# EAGLE design Sensor_AD7679 (EAGLE 9.6.2)
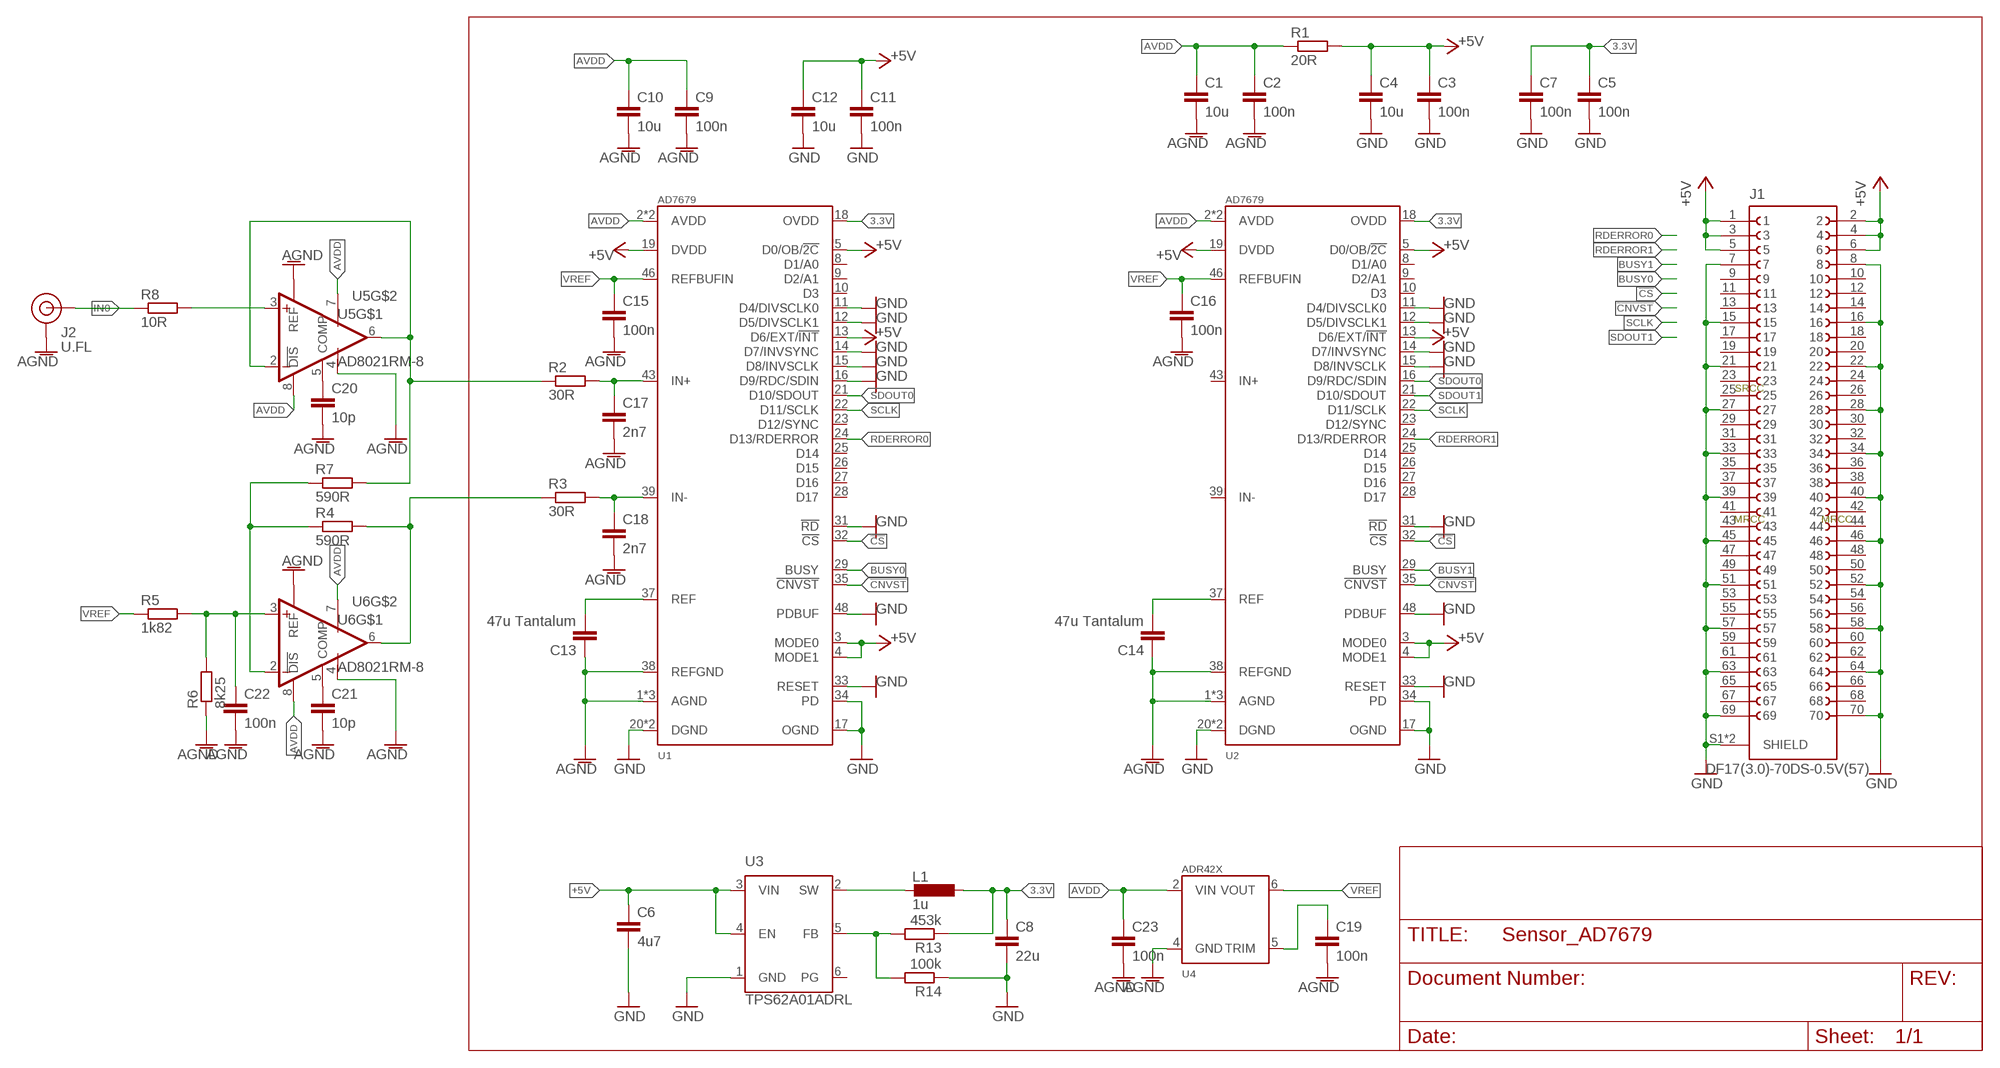
[diagram p0: schematic, sheet 1]

## Parts
C1  10u  C-EUC0603  [C0603]
C2  100n  C-EUC0402  [C0402]
C3  100n  C-EUC0402  [C0402]
C4  10u  C-EUC0603  [C0603]
C5  100n  C-EUC0402  [C0402]
C6  4u7  C-EUC0603  [C0603]
C7  100n  C-EUC0402  [C0402]
C8  22u  C-EUC0603  [C0603]
C9  100n  C-EUC0402  [C0402]
C10  10u  C-EUC0603  [C0603]
C11  100n  C-EUC0402  [C0402]
C12  10u  C-EUC0603  [C0603]
C13  47u Tantalum  C-EUC1206  [C1206]
C14  47u Tantalum  C-EUC1206  [C1206]
C15  100n  C-EUC0402  [C0402]
C16  100n  C-EUC0402  [C0402]
C17  2n7  C-EUC0402  [C0402]
C18  2n7  C-EUC0402  [C0402]
C19  100n  C-EUC0402  [C0402]
C20  10p  C-EUC0402  [C0402]
C21  10p  C-EUC0402  [C0402]
C22  100n  C-EUC0402  [C0402]
C23  100n  C-EUC0402  [C0402]
J1  DF17(3.0)-70DS-0.5V(57)  [DF17(3.0)-70DS-0.5V(57)]
J2  U.FL  U.FL2PIN  [U.FL]
L1  1u  L-EU1008  [L1008]
R1  20R  R-EU_R0402  [R0402]
R2  30R  R-EU_R0402  [R0402]
R3  30R  R-EU_R0402  [R0402]
R4  590R  R-EU_R0402  [R0402]
R5  1k82  R-EU_R0402  [R0402]
R6  8k25  R-EU_R0402  [R0402]
R7  590R  R-EU_R0402  [R0402]
R8  10R  R-EU_R0402  [R0402]
R13  453k  R-EU_R0402  [R0402]
R14  100k  R-EU_R0402  [R0402]
U1  AD7679  [LQFP48]
U2  AD7679  [LQFP48]
U3  TPS62A01ADRL  [SOTFL50P160X60-6N]
U4  ADR42X  [MSOP08]
U5  AD8021RM-8  [MSOP08]
U6  AD8021RM-8  [MSOP08]

## Nets
3.3V: C5.1 C7.1 C8.1 L1.1 R13.1 U1.18(OVDD) U2.18(OVDD)
!CNVST: U1.35(!CNVST) U2.35(!CNVST)
!CS: U1.32(!CS) U2.32(!CS)
+5V: C3.1 C4.1 C6.1 C11.1 C12.1 J1.1 J1.2 J1.3 J1.4 J1.5 J1.6 R1.2 U1.3(MODE0) U1.4(MODE1) U1.5(D0/OB/!2C) U1.19(DVDD) U2.3(MODE0) U2.4(MODE1) U2.5(D0/OB/!2C) U2.13(D6/EXT/!INT) U2.19(DVDD) U3.3(VIN) U3.4(EN)
AGND: C1.2 C2.2 C9.2 C10.2 C13.1 C14.1 C15.2 C16.2 C17.2 C18.2 C19.2 C20.2 C21.2 C22.2 C23.2 J2.1(GND) J2.2(GND) R6.1 U1.1(AGND) U1.36(AGND) U1.38(REFGND) U1.44(AGND) U2.1(AGND) U2.36(AGND) U2.38(REFGND) U2.44(AGND) U4.4(GND) U5.1(REF) U5.4(V-) U6.1(REF) U6.4(V-)
AVDD: C1.1 C2.1 C9.1 C10.1 C23.1 R1.1 U1.2(AVDD) U1.47(AVDD) U2.2(AVDD) U2.47(AVDD) U4.2(VIN) U5.7(V+) U5.8(!DIS) U6.7(V+) U6.8(!DIS)
BUSY0: U1.29(BUSY)
BUSY1: U2.29(BUSY)
GND: C3.2 C4.2 C5.2 C6.2 C7.2 C8.2 C11.2 C12.2 J1.7 J1.8 J1.15 J1.16 J1.21 J1.22 J1.27 J1.28 J1.33 J1.34 J1.39 J1.40 J1.45 J1.46 J1.51 J1.52 J1.57 J1.58 J1.63 J1.64 J1.69 J1.70 J1.S1(SHIELD) J1.S2(SHIELD) R14.1 U1.11(D4/DIVSCLK0) U1.12(D5/DIVSCLK1) U1.14(D7/INVSYNC) U1.17(OGND) U1.20(DGND) U1.30(DGND) U1.31(!RD) U1.33(RESET) U1.34(PD) U1.48(PDBUF) U2.11(D4/DIVSCLK0) U2.12(D5/DIVSCLK1) U2.14(D7/INVSYNC) U2.15(D8/INVSCLK) U2.17(OGND) U2.20(DGND) U2.30(DGND) U2.31(!RD) U2.33(RESET) U2.34(PD) U2.48(PDBUF) U3.1(GND)
IN0: J2.FEED(SIGNAL) R8.1
N$00001: U1.13(D6/EXT/!INT) ; supply symbol labelled +5V
N$00002: C13.2 U1.37(REF)
N$00003: C14.2 U2.37(REF)
N$00004: U1.15(D8/INVSCLK) U1.16(D9/RDC/SDIN) ; supply symbol labelled GND
N$00005: R2.1 R7.2 U5.2(-IN) U5.6(OUT)
N$00006: C20.1 U5.5(COMP)
N$00007: C17.1 R2.2 U1.43(IN+)
N$00008: C18.1 R3.2 U1.39(IN-)
N$00009: C19.1 U4.5(TRIM)
N$00010: R4.1 R7.1 U6.2(-IN)
N$00011: C21.1 U6.5(COMP)
N$00012: R3.1 R4.2 U6.6(OUT)
N$00013: C22.1 R5.2 R6.2 U6.3(+IN)
N$00015: R8.2 U5.3(+IN)
N$00044: R13.2 R14.2 U3.5(FB)
N$50: L1.2 U3.2(SW)
RDERROR0: U1.24(D13/RDERROR)
RDERROR1: U2.24(D13/RDERROR)
SCLK: U1.22(D11/SCLK) U2.22(D11/SCLK)
SDOUT0: U1.21(D10/SDOUT) U2.16(D9/RDC/SDIN)
SDOUT1: U2.21(D10/SDOUT)
VREF: C15.1 C16.1 R5.1 U1.46(REFBUFIN) U2.46(REFBUFIN) U4.6(VOUT)
Unconnected: J1.9 J1.10 J1.11 J1.12 J1.13 J1.14 J1.17 J1.18 J1.19 J1.20 J1.23 J1.24 J1.25 J1.26 J1.29 J1.30 J1.31 J1.32 J1.35 J1.36 J1.37 J1.38 J1.41 J1.42 J1.43 J1.44 J1.47 J1.48 J1.49 J1.50 J1.53 J1.54 J1.55 J1.56 J1.59 J1.60 J1.61 J1.62 J1.65 J1.66 J1.67 J1.68 U1.8(D1/A0) U1.9(D2/A1) U1.10(D3) U1.23(D12/SYNC) U1.25(D14) U1.26(D15) U1.27(D16) U1.28(D17) U2.8(D1/A0) U2.9(D2/A1) U2.10(D3) U2.23(D12/SYNC) U2.25(D14) U2.26(D15) U2.27(D16) U2.28(D17) U2.39(IN-) U2.43(IN+) U3.6(PG)

## Notes on the sheet
- SRCC
- MRCC | MRCC

## Library data of the parts
C1 C4 C10 C12 = rcl:C-EU: CAPACITOR, European symbol
C2 C3 C5 C7 C9 C11 C15 C16 C19 C22 C23 = rcl:C-EU: CAPACITOR, European symbol; LCSC: C1525
C6 = rcl:C-EU: CAPACITOR, European symbol; LCSC: C19666
C8 = rcl:C-EU: CAPACITOR, European symbol; LCSC: C109448
C13 C14 = rcl:C-EU: CAPACITOR, European symbol; DIGIKEY: 478-TCA0J476M8R-02CT-ND; SPICEPREFIX: C
C17 C18 C20 C21 = rcl:C-EU: CAPACITOR, European symbol; SPICEPREFIX: C
J1 = Hirose:DF17(3.0)-70DS-0.5V(57)
J2 = SparkFun-Connectors:U.FL2PIN: SMD Antenna Connector - U.FL 2mm height, 3.0mm x 3.0mm receptacle size. SparkFun Products: SparkFun WiFi Shield - ESP8266 <https://www.sparkfun.com/products/13287> SparkFun ESP8266 Thing <https://www.sparkfun.com/products/13231> SparkFun MiniGen - Pro Mini Signal Generator Shield <https://www.sparkfun.com/products/11420>; DIGIKEY: 26-U.FL-R-SMT-1(01)-ND; PROD_ID: CONN-09193; SF_ID: WRL-09144
L1 = rcl:L-EU: INDUCTOR, European symbol; DIGIKEY: 490-5112-1-ND; LCSC: C86091; MPN: LQM2HPN1R0MG0L
R1-R8 = rcl:R-EU_: RESISTOR, European symbol; SPICEPREFIX: R
R13 = rcl:R-EU_: RESISTOR, European symbol; LCSC: C137978; SPICEPREFIX: R
R14 = rcl:R-EU_: RESISTOR, European symbol; DIGIKEY: RMCF0402FT100KCT-ND; LCSC: C60491; SPICEPREFIX: R
U1 U2 = analog_devices:AD7679: AD7679 18-Bit, 2.5 LSB INL, 570 kSPS SAR ADC
U3 = TPS62A01DRLR:TPS62A01ADRL; DESCRIPTION: 2.5V-5.5V input, 1-A high efficiency step-down converter in 2x2 QFN or SOT563 package; DIGIKEY: 296-TPS62A01ADRLRCT-ND; HEIGHT: 0.6mm; LCSC: C5181455; MANUFACTURER_NAME: Texas Instruments; MANUFACTURER_PART_NUMBER: TPS62A01ADRLR; MOUSER: 595-TPS62A01ADRLR
U4 = analog_devices:ADR42X: ADR420/ADR421/ADR423/ADR425 Ultraprecision, Low Noise, 2.048 V/2.500 V/3.00 V/5.00 V Voltage References
U5 U6 = analog_devices:AD8021: AD8021 Low Noise, High Speed Amplifier for 16-Bit Systems

## Board
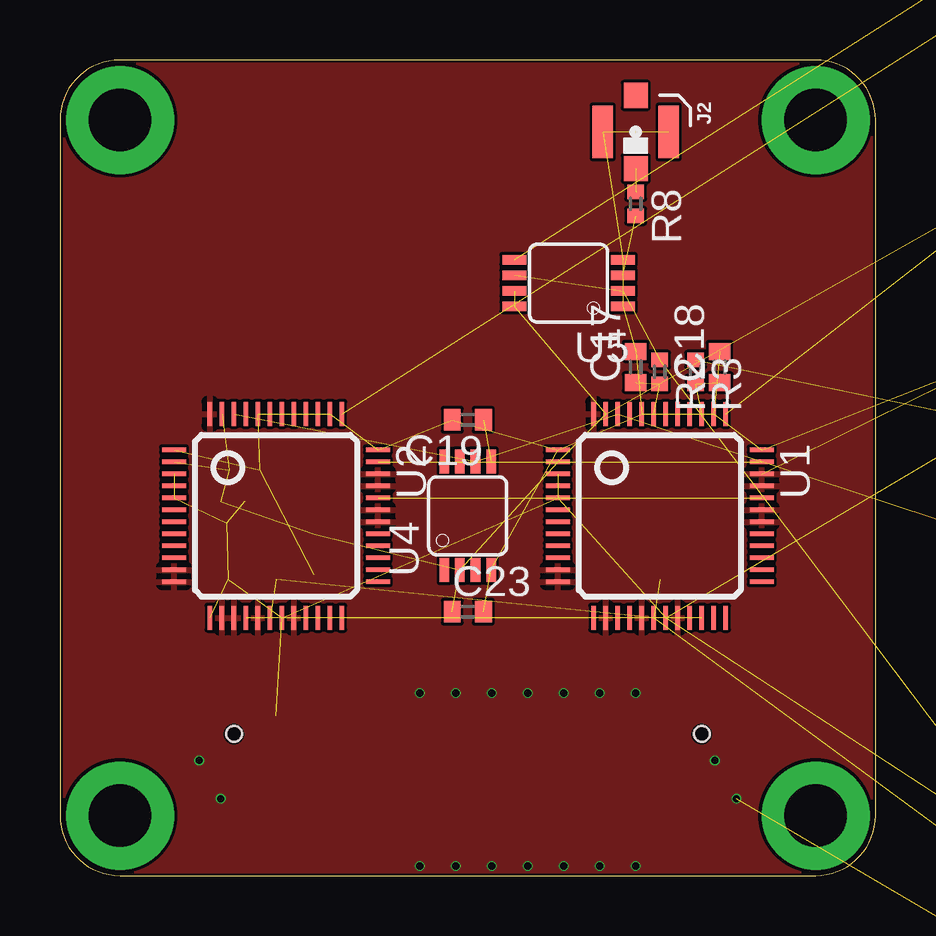
[diagram p1: board, top side]
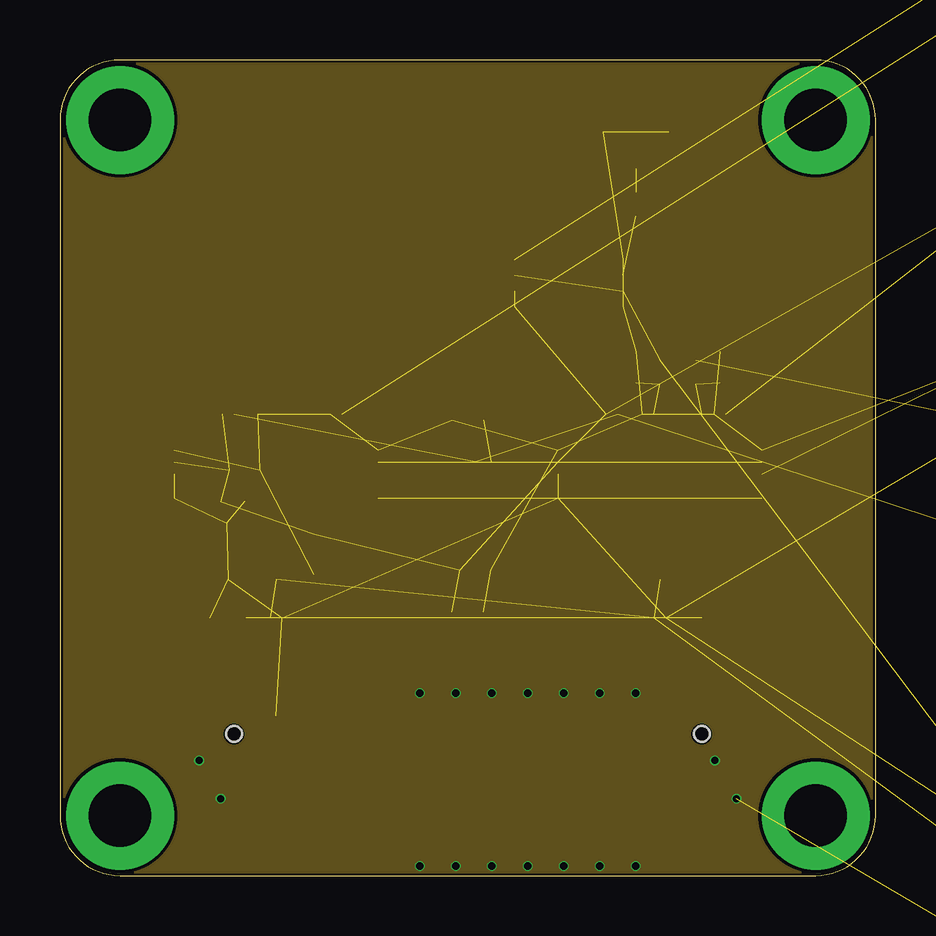
[diagram p2: board, inner layer Route2]
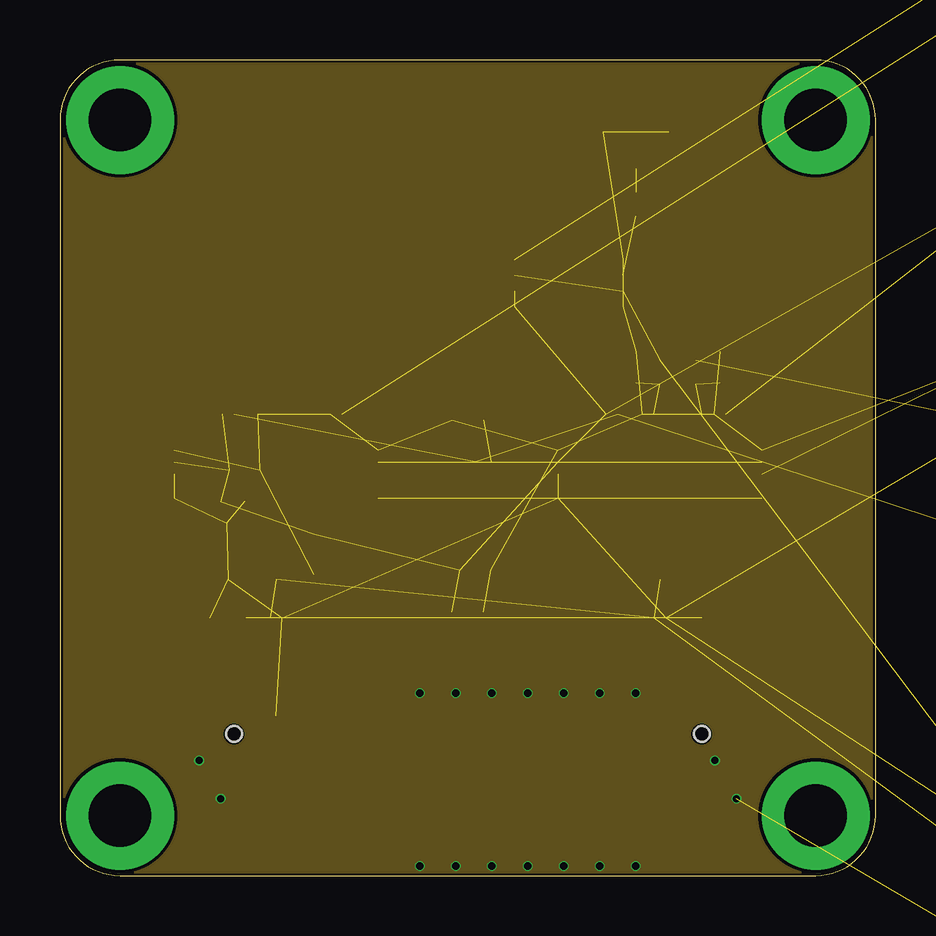
[diagram p3: board, inner layer Route15]
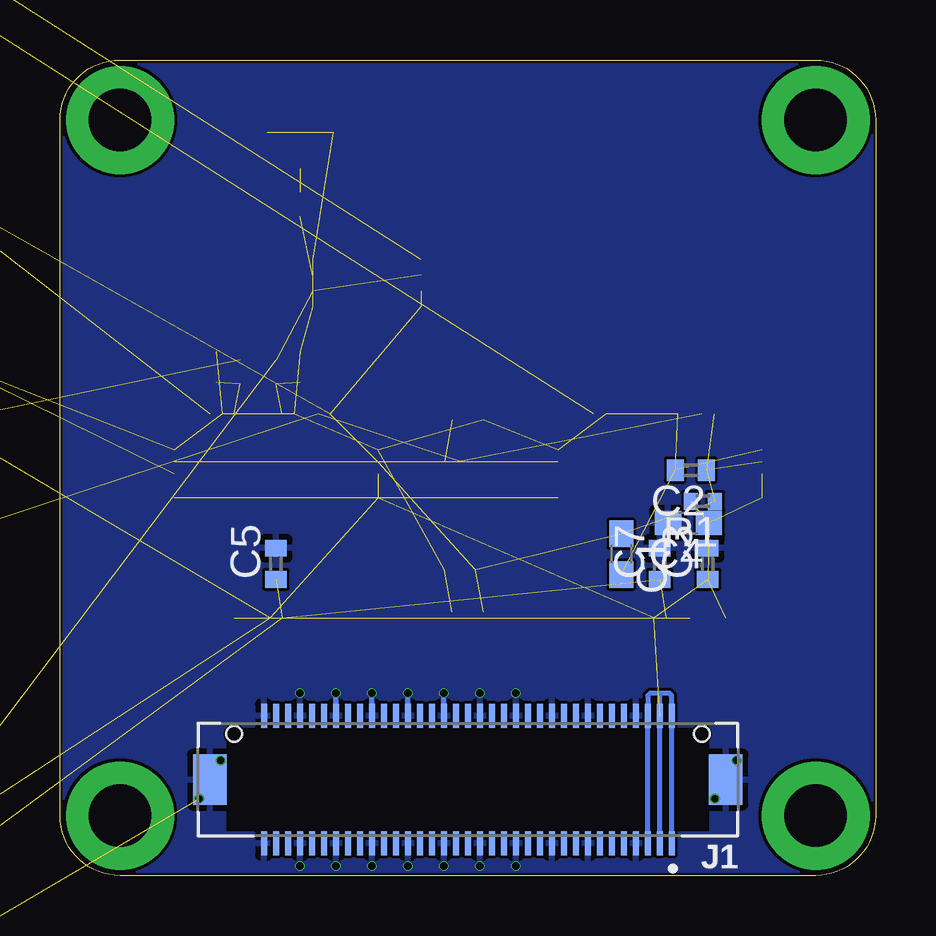
[diagram p4: board, bottom side, seen from below]

Size 34 x 34 mm. Coordinates in mm from the lower left corner, seen from the top.
Outline: 0,31.5 0,2.5 arc90 2.5,0 31.5,0 arc90 34,2.5 34,31.5 arc90 31.5,34 2.5,34 arc90 0,31.5
Copper layers (1*2*15*16): Top 0.035559375mm / dielectric 0.17018125mm / Route2 0.01778125mm / dielectric 47mil / Route15 0.01778125mm / dielectric 0.17018125mm / Bottom 0.035559375mm
Design rules "jlcpcb-4-layer *": minimum track width 5mil, minimum drill 0.2mm, track to track 5mil, track to pad 5mil, pad to pad 5mil, via to via 5mil, smd to smd 0mil, copper to edge 0.1mm, drill to drill 5mil, minimum pad ring 0.1mm, minimum via ring 0.05mm, stop-mask expansion 3mil, vias tented up to drill 100mil, thermal gap 10mil

### Footprints (pad centres in the part's own frame; a part is rotated, then mirrored left to right if it is on the bottom)
C0603 = smd 1.1 x 1: 1 -0.85,0; 2 0.85,0
C0402 = smd 0.7 x 0.9: 1 -0.65,0; 2 0.65,0
C1206 = smd 1.6 x 1.8: 1 -1.4,0; 2 1.4,0
DF17(3.0)-70DS-0.5V(57) = smd 0.25 x 1: 1 -8.5,2.65; 2 -8.5,-2.65; 3 -8,2.65; 4 -8,-2.65; 5 -7.5,2.65; 6 -7.5,-2.65; 7 -7,2.65; 8 -7,-2.65; 9 -6.5,2.65; 10 -6.5,-2.65; 11 -6,2.65; 12 -6,-2.65; 13 -5.5,2.65; 14 -5.5,-2.65; 15 -5,2.65; 16 -5,-2.65; 17 -4.5,2.65; 18 -4.5,-2.65; 19 -4,2.65; 20 -4,-2.65; 21 -3.5,2.65; 22 -3.5,-2.65; 23 -3,2.65; 24 -3,-2.65; 25 -2.5,2.65; 26 -2.5,-2.65; 27 -2,2.65; 28 -2,-2.65; 29 -1.5,2.65; 30 -1.5,-2.65; 31 -1,2.65; 32 -1,-2.65; 33 -0.5,2.65; 34 -0.5,-2.65; 35 0,2.65; 36 0,-2.65; 37 0.5,2.65; 38 0.5,-2.65; 39 1,2.65; 40 1,-2.65; 41 1.5,2.65; 42 1.5,-2.65; 43 2,2.65; 44 2,-2.65; 45 2.5,2.65; 46 2.5,-2.65; 47 3,2.65; 48 3,-2.65; 49 3.5,2.65; 50 3.5,-2.65; 51 4,2.65; 52 4,-2.65; 53 4.5,2.65; 54 4.5,-2.65; 55 5,2.65; 56 5,-2.65; 57 5.5,2.65; 58 5.5,-2.65; 59 6,2.65; 60 6,-2.65; 61 6.5,2.65; 62 6.5,-2.65; 63 7,2.65; 64 7,-2.65; 65 7.5,2.65; 66 7.5,-2.65; 67 8,2.65; 68 8,-2.65; 69 8.5,2.65; 70 8.5,-2.65 | smd 1.4 x 2.1: S1 -10.75,0; S2 10.75,0 | hole 0.65: -9.75,-1.9; 9.75,-1.9
U.FL = smd 2.2 x 0.85: 1 0,1.375; 2 0,-1.375 | smd 1.05 x 1: FEED 1.525,0; NC -1.525,0
L1008 = smd 0.8 x 2.2: 1 -1,0; 2 1,0
R0402 = smd 0.6 x 0.7: 1 -0.5,0; 2 0.5,0
LQFP48 = smd 0.2 x 1: 1 -2.75,-4.25; 2 -2.25,-4.25; 3 -1.75,-4.25; 4 -1.25,-4.25; 5 -0.75,-4.25; 6 -0.25,-4.25; 7 0.25,-4.25; 8 0.75,-4.25; 9 1.25,-4.25; 10 1.75,-4.25; 11 2.25,-4.25; 12 2.75,-4.25; 25 2.75,4.25; 26 2.25,4.25; 27 1.75,4.25; 28 1.25,4.25; 29 0.75,4.25; 30 0.25,4.25; 31 -0.25,4.25; 32 -0.75,4.25; 33 -1.25,4.25; 34 -1.75,4.25; 35 -2.25,4.25; 36 -2.75,4.25 | smd 1 x 0.2: 13 4.25,-2.75; 14 4.25,-2.25; 15 4.25,-1.75; 16 4.25,-1.25; 17 4.25,-0.75; 18 4.25,-0.25; 19 4.25,0.25; 20 4.25,0.75; 21 4.25,1.25; 22 4.25,1.75; 23 4.25,2.25; 24 4.25,2.75; 37 -4.25,2.75; 38 -4.25,2.25; 39 -4.25,1.75; 40 -4.25,1.25; 41 -4.25,0.75; 42 -4.25,0.25; 43 -4.25,-0.25; 44 -4.25,-0.75; 45 -4.25,-1.25; 46 -4.25,-1.75; 47 -4.25,-2.25; 48 -4.25,-2.75
SOTFL50P160X60-6N = smd 0.475 x 0.3: 1 -0.838,0.5; 2 -0.838,0; 3 -0.838,-0.5; 4 0.838,-0.5; 5 0.838,0; 6 0.838,0.5
MSOP08 = smd 0.4 x 1: 1 -0.976,-2.263; 2 -0.326,-2.263; 3 0.324,-2.263; 4 0.974,-2.263; 5 0.974,2.262; 6 0.324,2.262; 7 -0.326,2.262; 8 -0.976,2.262

### Placement (x,y rotation side)
C1  10.6,13.4 270 bottom
C2  7.7,16.9 180 bottom
C3  7,13 90 bottom
C4  7.8,14.7 180 bottom
C5  25,13 90 bottom
C6  58.8,-11.7 180 top  (outside the outline)
C7  9,13 90 bottom
C8  54.4,-11.7 180 top  (outside the outline)
C9  58.8,21.2 180 top  (outside the outline)
C10  58.8,26.1 180 top  (outside the outline)
C11  58.8,31 180 top  (outside the outline)
C12  58.8,35.9 180 top  (outside the outline)
C13  57.8,41.5 180 top  (outside the outline)
C14  57.8,47.7 180 top  (outside the outline)
C15  58.8,53.3 180 top  (outside the outline)
C16  58.8,58.2 180 top  (outside the outline)
C17  24,21.2 90 top
C18  27.5,21.2 90 top
C19  17,19 180 top
C20  42.2,40.1 0 top  (outside the outline)
C21  42.2,23.1 0 top  (outside the outline)
C22  42.2,3.5 0 top  (outside the outline)
C23  17,11 0 top
J1  17,4 180 bottom
J2  24,31 270 top
L1  57.3,-17.3 180 top  (outside the outline)
R1  7.2,15.6 180 bottom
R2  25,21 270 top
R3  26.5,21 270 top
R4  41.8,18.2 0 top  (outside the outline)
R5  41.8,13.3 0 top  (outside the outline)
R6  41.8,8.4 0 top  (outside the outline)
R7  41.8,-1.4 0 top  (outside the outline)
R8  24,28 270 top
R13  54.6,-17.9 180 top  (outside the outline)
R14  49.7,-17.9 180 top  (outside the outline)
U1  25,15 270 top
U2  9,15 270 top
U3  53.1,-24 180 top  (outside the outline)
U4  17,15 0 top
U5  21.2,24.7 90 top
U6  44.5,28.7 0 top  (outside the outline)

### Tracks (layer width: path | path; a pad name or v marks a point on that pad's centre or on a via)
3.3V  (6 unrouted)
!CNVST  (1 unrouted)
!CS  (1 unrouted)
+5V  (17 unrouted)
  Bottom 0.2: J1.1 J1.2 8.5,7.5 8.6,7.6 9,7.6 | J1.3 J1.4 9,7.6 | J1.5 J1.6 9.5,7.5 9.4,7.6 9,7.6
AGND  (30 unrouted)
AVDD  (14 unrouted)
GND  (via drill 0.3)  (6 unrouted)
  Bottom 0.2: J1.40 v18,7.6 | J1.46 v19.5,7.6 | J1.52 v21,7.6 | J1.58 v22.5,7.6
  other vias: 24,7.6 16.5,7.6 15,0.4 16.5,0.4 18,0.4 19.5,0.4 21,0.4 22.5,0.4 24,0.4 5.8,4.8 6.7,3.2 27.3,4.8 28.2,3.2 15,7.6
  pour Top: 0,0 34,0 34,34 0,34
  pour Bottom: 0,0 34,0 34,34 0,34
  pour Route15: 0,0 34,0 34,34 0,34
  pour Route2: 0,0 34,0 34,34 0,34
IN0  (1 unrouted)
N$00002  (1 unrouted)
N$00003  (1 unrouted)
N$00004  (1 unrouted)
N$00005  (3 unrouted)
N$00006  (1 unrouted)
N$00007  (2 unrouted)
N$00008  (2 unrouted)
N$00009  (1 unrouted)
N$00010  (2 unrouted)
N$00011  (1 unrouted)
N$00012  (2 unrouted)
N$00013  (3 unrouted)
N$00015  (1 unrouted)
N$00025  (via drill 2.6 pad 4.5)
  other vias: 2.5,31.5
N$00026  (via drill 2.6 pad 4.5)
  other vias: 31.5,31.5
N$00027  (via drill 2.6 pad 4.5)
  other vias: 2.5,2.5
N$00028  (via drill 2.6 pad 4.5)
  other vias: 31.5,2.5
N$00044  (2 unrouted)
N$50  (1 unrouted)
SCLK  (1 unrouted)
SDOUT0  (1 unrouted)
VREF  (5 unrouted)

### Text on the board
tStop: CAMERALINK